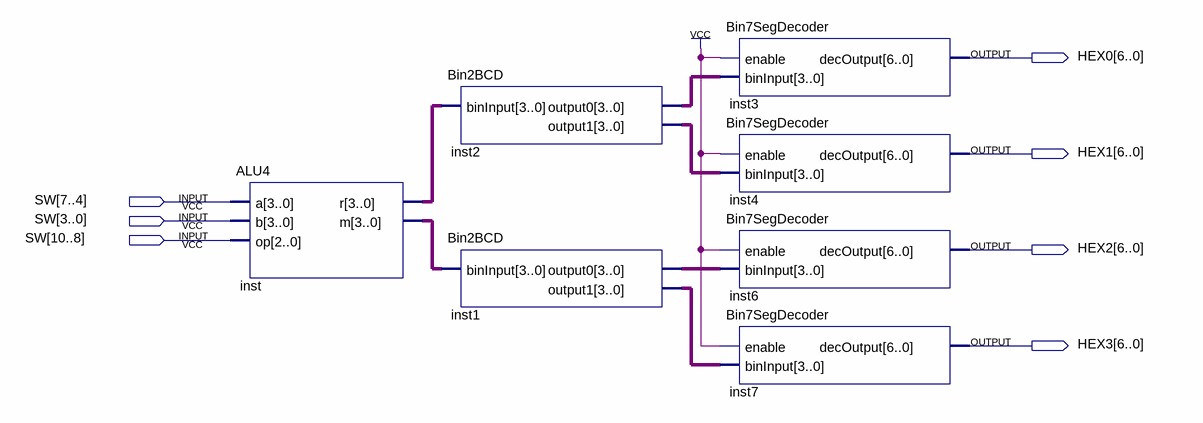
[diagram p0: schematic sheet]
// Quartus schematic ALUDemo.bdf as structural Verilog: 7 symbols, 7 pins
module ALUDemo (
  input  [10:0] SW,
  output [6:0] HEX0,
  output [6:0] HEX1,
  output [6:0] HEX2,
  output [6:0] HEX3
);

  wire [3:0] inst1_output0, inst1_output1, inst2_output0, inst2_output1, inst_m, inst_r;

  ALU4 inst (.a(SW[7:4]), .b(SW[3:0]), .op(SW[10:8]), .r(inst_r), .m(inst_m));
  Bin2BCD inst2 (.binInput(inst_r), .output0(inst2_output0), .output1(inst2_output1));
  Bin2BCD inst1 (.binInput(inst_m), .output0(inst1_output0), .output1(inst1_output1));
  Bin7SegDecoder inst3 (.enable(1'b1), .binInput(inst2_output0), .decOutput(HEX0));
  Bin7SegDecoder inst4 (.enable(1'b1), .binInput(inst2_output1), .decOutput(HEX1));
  Bin7SegDecoder inst6 (.enable(1'b1), .binInput(inst1_output0), .decOutput(HEX2));
  Bin7SegDecoder inst7 (.enable(1'b1), .binInput(inst1_output1), .decOutput(HEX3));
endmodule
